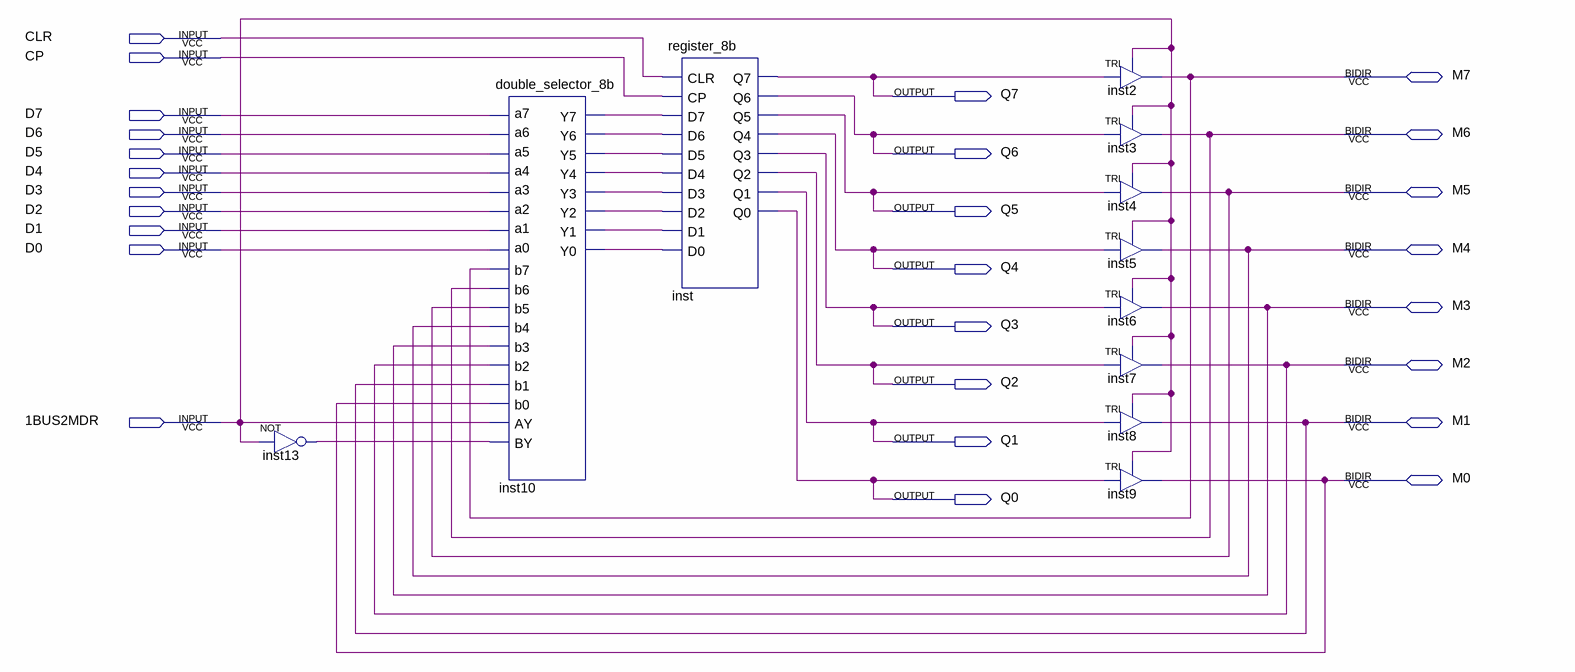
[diagram p0: schematic sheet]
// Quartus schematic MDR_8b.bdf as structural Verilog: 11 symbols, 27 pins
module MDR_8b (
  input  CLR,
  input  CP,
  input  D7,
  input  D6,
  input  D5,
  input  D4,
  input  D3,
  input  D2,
  input  D1,
  input  D0,
  input  \1BUS2MDR ,
  inout  M7,
  inout  M6,
  inout  M5,
  inout  M4,
  inout  M3,
  inout  M2,
  inout  M1,
  inout  M0,
  output Q7,
  output Q6,
  output Q5,
  output Q4,
  output Q3,
  output Q2,
  output Q1,
  output Q0
);

  wire inst10_y0, inst10_y1, inst10_y2, inst10_y3, inst10_y4, inst10_y5, inst10_y6, inst10_y7, inst13_out;

  not inst13 (inst13_out, \1BUS2MDR );
  double_selector_8b inst10 (
    .a0(D0), .a1(D1), .a2(D2), .a3(D3), .a4(D4), .a5(D5), .a6(D6), .a7(D7), .b0(M0), .b1(M1), .b2(M2),
    .b3(M3), .b4(M4), .b5(M5), .b6(M6), .b7(M7), .AY(\1BUS2MDR ), .BY(inst13_out), .Y0(inst10_y0),
    .Y1(inst10_y1), .Y2(inst10_y2), .Y3(inst10_y3), .Y4(inst10_y4), .Y5(inst10_y5), .Y6(inst10_y6),
    .Y7(inst10_y7));
  register_8b inst (
    .CLR(CLR), .CP(CP), .D7(inst10_y7), .D6(inst10_y6), .D5(inst10_y5), .D4(inst10_y4), .D3(inst10_y3),
    .D2(inst10_y2), .D1(inst10_y1), .D0(inst10_y0), .Q7(Q7), .Q6(Q6), .Q5(Q5), .Q4(Q4), .Q3(Q3), .Q2(Q2),
    .Q1(Q1), .Q0(Q0));
  TRI inst2 (.IN(Q7), .OE(\1BUS2MDR ), .OUT(M7));
  TRI inst3 (.IN(Q6), .OE(\1BUS2MDR ), .OUT(M6));
  TRI inst4 (.IN(Q5), .OE(\1BUS2MDR ), .OUT(M5));
  TRI inst5 (.IN(Q4), .OE(\1BUS2MDR ), .OUT(M4));
  TRI inst6 (.IN(Q3), .OE(\1BUS2MDR ), .OUT(M3));
  TRI inst7 (.IN(Q2), .OE(\1BUS2MDR ), .OUT(M2));
  TRI inst8 (.IN(Q1), .OE(\1BUS2MDR ), .OUT(M1));
  TRI inst9 (.IN(Q0), .OE(\1BUS2MDR ), .OUT(M0));
endmodule
